# Altium schematic sheet Nixie_PSU.SchDoc
size A4; SheetNumber: 1; SheetTotal: 1
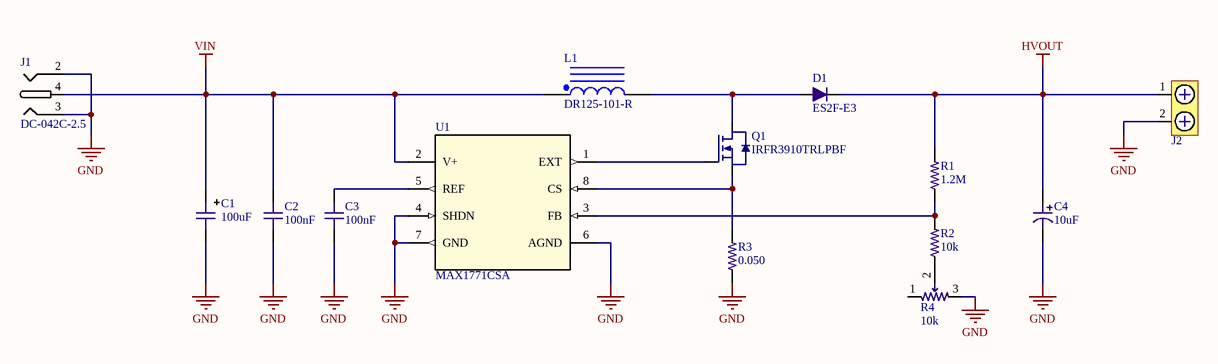
[diagram p0: Nixie_PSU.SchDoc]

## Parts
C1  value 100uF  [C2917]  (hidden comment: TPSD107M020R0150)
C2  value 100nF  [C0603-IPC]  (hidden comment: C0603 100nF 50V X7R)
C3  value 100nF  [C0603-IPC]  (hidden comment: C0603 100nF 50V X7R)
C4  value 10uF  [C-SMD-Polarized-10x10.2x17mm]  (hidden comment: EEV-EB2E100Q)
D1  ES2F-E3  [DO-214AA]
J1  DC-042C-2.5  [DC-042C-2.5 THT BARREL JACK]
J2  Phoenix Contact 1935161  [Phoenix_1935161]  (value not drawn)
L1  DR125-101-R  [EATN-DR125_V]
Q1  IRFR3910TRLPBF  [DPAK2 IRFR3910]
R1  value 1.2M  [R1206-IPC]  (hidden comment: RC1206JR-071M2L)
R2  value 10k  [R0603-IPC-10K]  (hidden comment: R0603 10K 1%)
R3  value 0.050  [R1206-IPC-0R050]  (hidden comment: CSNL1206FT50L0)
R4  value 10k  [CT-6EP]  (hidden comment: Trimmer 10k 1%)
U1  MAX1771CSA  [SOIC-8N - MAX1771]

## Nets
GND: C1.2 C2.1 C3.1 C4.2 J1.2 J1.3 J2.2 R3.1 R4.3 U1.4(SHDN) U1.6(AGND) U1.7(GND)
HVOUT: C4.1 D1.1 J2.1 R1.2
VIN: C1.1 C2.2 J1.4 L1.1 U1.2(V+)
NetC3_2: C3.2 U1.5(REF)
NetD1_2: D1.2 L1.2 Q1.2(D)
NetQ1_1: Q1.1(G) U1.1(EXT)
NetQ1_3: Q1.3(S) R3.2 U1.8(CS)
NetR1_1: R1.1 R2.2 U1.3(FB)
NetR2_1: R2.1 R4.2(W)

Not connected (* = marked no-connect by the designer): R4 1

## Library data of the parts
C1 = C2917 100uF 25V TANT: CAP TANT 100UF 25V 10% 2917; Supplier 1: Digi-Key; Supplier Part Number 1: 478-TPSD107M020R0150CT-ND; Supplier 2: Mouser; Supplier Part Number 2: 581-TPSD107M020R0150
C2 C3 = C0603 100nF 50V X7R: CAP CER 0.1UF 50V X7R 0603; EIA Code: X7R; Max. Voltage: 50V; Features: Soft Termination; Ratings: AEC-Q200; Supplier 1: Digi-Key; Supplier Part Number 1: 490-5798-1-ND
C4 = C-SMD 10uF 250V Electrolytic: 10 µF 250 V Aluminum Electrolytic Capacitors Radial, Can - SMD - 4000 Hrs @ 105°C; Voltage: 250V; Supplier 1: Digi-Key; Supplier 2: Mouser; Supplier Part Number 1: PCE3432CT-ND; Supplier Part Number 2: 667-EEV-EB2E100Q
D1 = ES2F-E3: Diode Standard 300 V 2A 35ns Trr Surface Mount DO-214AA (SMB); Supplier 1: Digi-Key; Supplier 2: Mouser; Supplier Part Number 1: ES2F-E3/5BTGICT-ND; Supplier Part Number 2: 625-ES2F-E3/5BT
J1 = DC Barrel Jack 2.5 x 5.5mm THT: DC Power Receptacle Jack 8A 2.5mm DIP AC/DC Power Plugs & Receptacles; Voltage Rating: 24V; Supplier 3: LCSC; Supplier Part Number 3: C319121; Current Rating: 8A; Inside Contact Diameter: 2.5mm
J2 = Term Block 2pos: Terminal Block, 2 Position, 5mm pitch, 18A, 300V, 12-26 AWG; Manufacturer: Phoenix Contact; Manufacturer Part Number: 1935161; Supplier 1: Digi-Key; Supplier Part Number 1: 277-1667-ND
L1 = CMP-2000-06178-1: High Power Density, High Efficiency, Shielded Inductor, 100 uH, 1.78 A, -40 to 125 degC, 2-Pin SMD, RoHS, Tape and Reel; Manufacturer: EATON; Tolerance (%): ±20%; Inductance-Nom: 100µH; Shielding: Yes; DC Resistance: 0.17O; Rated Current-Max: 1.78A; Datasheet URL: https://ciiva.com/datasheet-click-3083294?src=ciiva&sig=4634c5cd; Case Size/Dimension: 12.5x12.5x6mm; Package Description: 2-Pin Surface Mount Device, Body 12.5 x 12.5 mm; Datasheet Version: 04/2014; Package Reference: DR125; Manufacturer URL: http://www.eaton.com/; Mounting Technology: SurfaceMount
Q1 = IRFR3910TRLPBF: N-Channel 16A (Tc) 79W (Tc) Surface Mount D-Pak; Supplier 1: Digi-Key; Supplier 2: Mouser; Supplier 3: LCSC; Supplier Part Number 1: IRFR3910TRLPBFCT-ND; Supplier Part Number 2: 942-IRFR3910TRLPBF; Supplier Part Number 3: C148158
R1 = R1206 1.2M 1%: 1.2 MOhms ±5% 0.25W, 1/4W Chip Resistor 1206 (3216 Metric) Moisture Resistant Thick Film; Supplier 1: Digi-Key; Supplier 2: Mouser; Supplier Part Number 1: 311-1.2MERCT-ND; Supplier Part Number 2: 603-RC1206JR-071M2L
R2 = R0603 10K 1%: RES SMD 10K OHM 1% 1/10W 0603; Supplier 1: Digi-Key; Supplier Part Number 1: RMCF0603FT10K0CT-ND
R3 = R1206 0R050 1%: RES 0.05 OHM 1% 1W 1206; Supplier 1: Digi-Key; Supplier Part Number 1: CSNL1206FT50L0CT-ND
R4 = Trimmer 100k 1%: Trimmer, 10k, 1 Turn, Thru-Hole, Cermet, 100ppm/C
U1 = MAX1771CSA: Boost, Buck-Boost Regulator Positive Output Step-Up, Step-Up/Step-Down - DC-DC Controller IC 8-SOIC; Supplier 1: Digi-Key; Supplier 2: Mouser; Supplier Part Number 1: MAX1771CSA+-ND; Supplier Part Number 2: 700-MAX1771CSA; Supplier Part Number 3: C407903; Supplier 3: LCSC